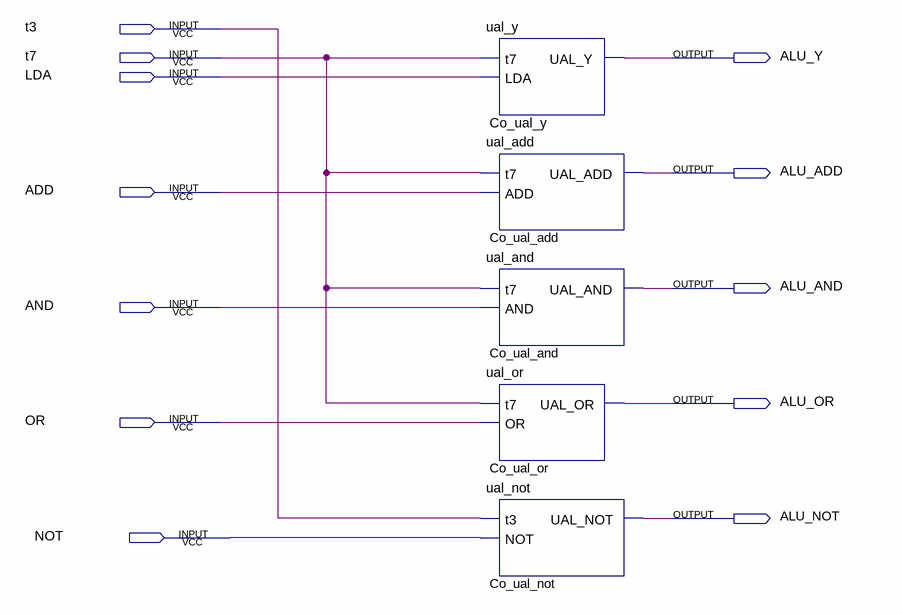
[diagram p0: schematic sheet]
// Quartus schematic uc_alu.bdf as structural Verilog: 5 symbols, 12 pins
module uc_alu (
  input  t3,
  input  t7,
  input  LDA,
  input  ADD,
  input  AND,
  input  OR,
  input  NOT,
  output ALU_Y,
  output ALU_ADD,
  output ALU_AND,
  output ALU_OR,
  output ALU_NOT
);

  ual_y Co_ual_y (.t7(t7), .LDA(LDA), .UAL_Y(ALU_Y));
  ual_add Co_ual_add (.t7(t7), .ADD(ADD), .UAL_ADD(ALU_ADD));
  ual_and Co_ual_and (.t7(t7), .AND(AND), .UAL_AND(ALU_AND));
  ual_or Co_ual_or (.t7(t7), .OR(OR), .UAL_OR(ALU_OR));
  ual_not Co_ual_not (.t3(t3), .NOT(NOT), .UAL_NOT(ALU_NOT));
endmodule
